# Altium schematic sheet RF_pwr_v2.SchDoc: Материнская плата
size 420 x 297 mm; DrawnBy: В.Титов; DocumentNumber: ХХХХ.468179.001 Э3; SheetNumber: 3; SheetTotal: 3; DocumentType: Схема электрическая принципиальная; Title2: Питание процессора
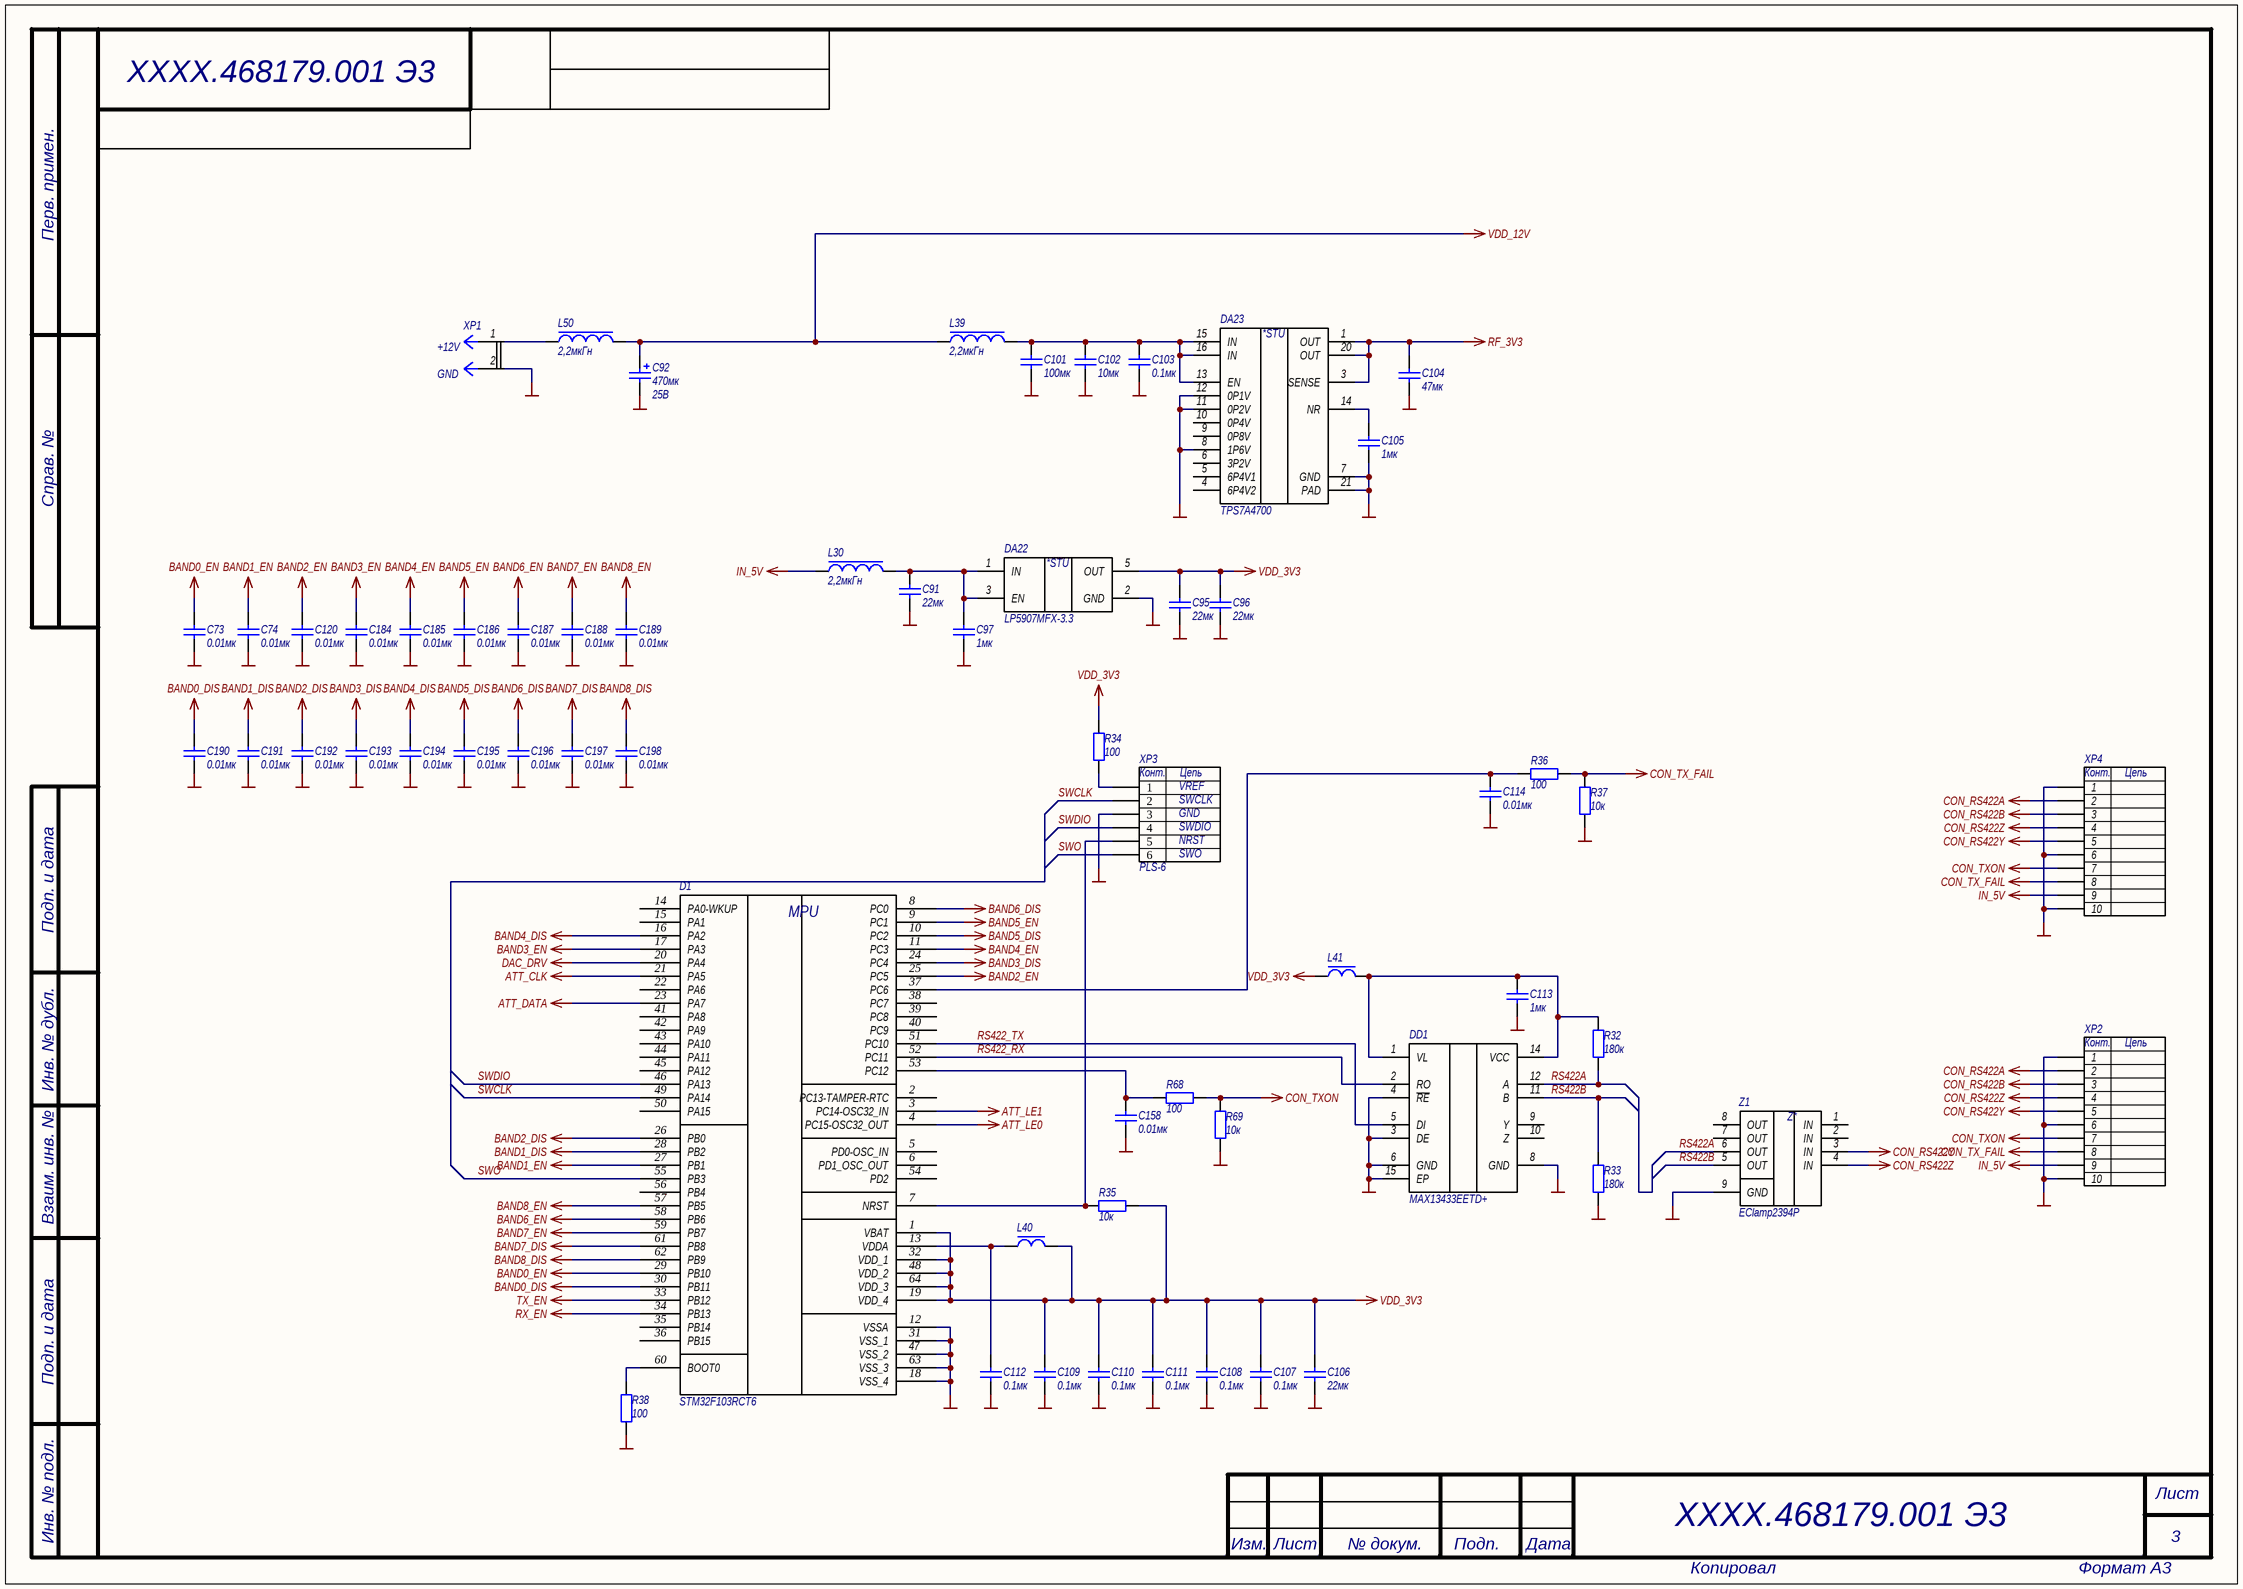
[diagram p0: RF_pwr_v2.SchDoc]

## Parts
C73  0.01мк  [CAPC1005X06N]
C74  0.01мк  [CAPC1005X06N]
C91  22мк  [CAPC2012X12L]
C92  Power/Voltage: 25В  [CAPAE116103X105N]  (hidden comment: 470мк)
C95  22мк  [CAPC2012X12L]
C96  22мк  [CAPC2012X12L]
C97  1мк  [CAPC1005X06N]
C101  100мк  [CAPC3216X19L]
C102  10мк  [CAPC1608X08L]
C103  0.1мк  [CAPC1005X06N]
C104  47мк  [CAPC2012X12L]
C105  1мк  [CAPC1005X06N]
C106  22мк  [CAPC2012X12L]
C107  0.1мк  [CAPC1005X06N]
C108  0.1мк  [CAPC1005X06N]
C109  0.1мк  [CAPC1005X06N]
C110  0.1мк  [CAPC1005X06N]
C111  0.1мк  [CAPC1005X06N]
C112  0.1мк  [CAPC1005X06N]
C113  1мк  [CAPC1005X06N]
C114  0.01мк  [CAPC1005X06N]
C120  0.01мк  [CAPC1005X06N]
C158  0.01мк  [CAPC1005X06N]
C184  0.01мк  [CAPC1005X06N]
C185  0.01мк  [CAPC1005X06N]
C186  0.01мк  [CAPC1005X06N]
C187  0.01мк  [CAPC1005X06N]
C188  0.01мк  [CAPC1005X06N]
C189  0.01мк  [CAPC1005X06N]
C190  0.01мк  [CAPC1005X06N]
C191  0.01мк  [CAPC1005X06N]
C192  0.01мк  [CAPC1005X06N]
C193  0.01мк  [CAPC1005X06N]
C194  0.01мк  [CAPC1005X06N]
C195  0.01мк  [CAPC1005X06N]
C196  0.01мк  [CAPC1005X06N]
C197  0.01мк  [CAPC1005X06N]
C198  0.01мк  [CAPC1005X06N]
D1  STM32F103RCT6  [QFP50P1200X1200X160-64N]
DA22  LP5907MFX-3.3  [SOT23-5AM]
DA23  TPS7A4700  [QFN65P500X500X100_HS-21L]
DD1  MAX13433EETD+  [SON40P300X80_HS-15L]
L30  2,2мкГн  [CSAB0420]
L39  2,2мкГн  [CSAB0420]
L40  BLM18PG121SN1D  [INDC1608X08L]  (value not drawn)
L41  BLM18PG121SN1D  [INDC1608X08L]  (value not drawn)
L50  2,2мкГн  [CSAB0420]
R32  180к  [RESC1005X06N]
R33  180к  [RESC1005X06N]
R34  100  [RESC1005X06N]
R35  10к  [RESC1005X06N]
R36  100  [RESC1005X06N]
R37  10к  [RESC1005X06N]
R38  100  [RESC1005X06N]
R68  100  [RESC1005X06N]
R69  10к  [RESC1005X06N]
XP1  XT30UPB-M  [XT30UPB-M]  (value not drawn)
XP2  FH12-10S-0.5SVA  [FH12-10S-0.5SH]  (value not drawn)
XP3  PLS-6  [HDR1X6]
XP4  FH12-10S-0.5SVA  [FH12-10S-0.5SH]  (value not drawn)
Z1  EClamp2394P  [SON50P160X65_HS-9N]

## Nets
ATT_CLK: D1.21(PA5)
ATT_DATA: D1.23(PA7)
ATT_LE0: D1.4(PC15-OSC32_OUT)
ATT_LE1: D1.3(PC14-OSC32_IN)
BAND0_DIS: C190.2 D1.30(PB11)
BAND0_EN: C73.2 D1.29(PB10)
BAND1_DIS: C191.2 D1.28(PB2)
BAND1_EN: C74.2 D1.27(PB1)
BAND2_DIS: C192.2 D1.26(PB0)
BAND2_EN: C120.2 D1.25(PC5)
BAND3_DIS: C193.2 D1.24(PC4)
BAND3_EN: C184.2 D1.17(PA3)
BAND4_DIS: C194.2 D1.16(PA2)
BAND4_EN: C185.2 D1.11(PC3)
BAND5_DIS: C195.2 D1.10(PC2)
BAND5_EN: C186.2 D1.9(PC1)
BAND6_DIS: C196.2 D1.8(PC0)
BAND6_EN: C187.2 D1.58(PB6)
BAND7_DIS: C197.2 D1.61(PB8)
BAND7_EN: C188.2 D1.59(PB7)
BAND8_DIS: C198.2 D1.62(PB9)
BAND8_EN: C189.2 D1.57(PB5)
CON_RS422A: XP2.2 XP4.2
CON_RS422B: XP2.3 XP4.3
CON_RS422Y: XP2.5 XP4.5 Z1.3(IN)
CON_RS422Z: XP2.4 XP4.4 Z1.4(IN)
CON_TX_FAIL: R36.1 R37.1 XP2.8 XP4.8
CON_TXON: R68.1 R69.1 XP2.7 XP4.7
DAC_DRV: D1.20(PA4)
GND: C73.1 C74.1 C91.1 C92.2 C95.1 C96.1 C97.1 C101.1 C102.1 C103.1 C104.1 C105.1 C106.1 C107.1 C108.1 C109.1 C110.1 C111.1 C112.1 C113.1 C114.1 C120.1 C158.1 C184.1 C185.1 C186.1 C187.1 C188.1 C189.1 C190.1 C191.1 C192.1 C193.1 C194.1 C195.1 C196.1 C197.1 C198.1 D1.12(VSSA) D1.18(VSS_4) D1.31(VSS_1) D1.47(VSS_2) D1.63(VSS_3) DA22.2(GND) DA23.7(GND) DA23.8(1P6V) DA23.11(0P2V) DA23.12(0P1V) DA23.21(PAD) DD1.3(DE) DD1.4(~{RE}) DD1.6(GND) DD1.8(GND) DD1.15(EP) R33.1 R37.2 R38.2 R69.2 XP1.2 XP2.1 XP2.6 XP2.10 XP3.3 XP4.1 XP4.6 XP4.10 Z1.9(GND)
IN_5V: L30.1 XP2.9 XP4.9
RF_3V3: C104.2 DA23.1(OUT) DA23.3(SENSE) DA23.20(OUT)
RX_EN: D1.34(PB13)
TX_EN: D1.33(PB12)
VDD_3V3: C95.2 C96.2 C106.2 C107.2 C108.2 C109.2 C110.2 C111.2 D1.1(VBAT) D1.19(VDD_4) D1.32(VDD_1) D1.48(VDD_2) D1.64(VDD_3) DA22.5(OUT) L40.2 L41.1 R34.1 R35.2
VDD_12V: C92.1 L39.1 L50.2
RS422_RX: D1.52(PC11) DD1.2(RO)
RS422_TX: D1.51(PC10) DD1.5(DI)
RS422A: DD1.12(A) R32.1 Z1.6(OUT)
RS422B: DD1.11(B) R33.2 Z1.5(OUT)
SWCLK: D1.49(PA14) XP3.2
SWDIO: D1.46(PA13) XP3.4
SWO: D1.55(PB3) XP3.6
NetC91_2: C91.2 C97.2 DA22.1(IN) DA22.3(EN) L30.2
NetC101_2: C101.2 C102.2 C103.2 DA23.13(EN) DA23.15(IN) DA23.16(IN) L39.2
NetC105_2: C105.2 DA23.14(NR)
NetC112_2: C112.2 D1.13(VDDA) L40.1
NetC113_2: C113.2 DD1.1(VL) DD1.14(VCC) L41.2 R32.2
NetC114_2: C114.2 D1.37(PC6) R36.2
NetC158_2: C158.2 D1.53(PC12) R68.2
NetD1_7: D1.7(NRST) R35.1 XP3.5
NetD1_60: D1.60(BOOT0) R38.1
NetL50_1: L50.1 XP1.1
NetR34_2: R34.2 XP3.1

Not connected (* = marked no-connect by the designer): D1 2(PC13-TAMPER-RTC) 5(PD0-OSC_IN) 6(PD1_OSC_OUT) 14(PA0-WKUP) 15(PA1) 22(PA6) 35(PB14) 36(PB15) 38(PC7) 39(PC8) 40(PC9) 41(PA8) 42(PA9) 43(PA10) 44(PA11) 45(PA12) 50(PA15) 54(PD2) 56(PB4); DA23 4(6P4V2) 5(6P4V1) 6(3P2V) 9(0P8V) 10(0P4V); DD1 9(Y) 10(Z); Z1 1(IN) 2(IN) 7(OUT) 8(OUT)

## Notes on the sheet
- (near XP1) GND
- (near XP1) +12V
- (near XP3) VREF
- (near XP3) SWCLK
- (near XP3) GND
- (near XP3) SWDIO
- (near XP3) NRST
- (near XP3) SWO
- Перв. примен.
- Справ. №
- Подп. и дата
- Инв. № дубл.
- Взаим. инв. №
- Инв. № подл.
- Лист
- Изм.
- № докум.
- Подп.
- Дата
- Копировал
- Формат А3
- (in symbol Микросхема LP5907MFX-3.3) *STU
- (in symbol Микросхема STM32F103RCT6) MPU
- (in symbol Микросхема TPS7A4700RGW) *STU
- (in symbol Соединитель FH12-10S-0.5SVA) Конт.; Цепь
- (in symbol Соединитель PLS-6) Конт.; Цепь
- (in symbol Фильтр EMI EClamp2394P) Z*

## Library data of the parts
C73 C74 C114 C120 C158 C184-C198 = Кер.ЧИП конд. 0402 0.01мкФ X7R 10%, 50В: Кер. ЧИП-конденсатор; Power/Voltage: 50В; TKE: X7R; Tolerance: ±20%; Value: 0.01мк
C91 C95 C96 C106 = Кер.ЧИП конд. 0805 22мкФ X5R 10% 16В: Кер. ЧИП-конденсатор; Manufacturer: TDK; ManufacturerPartNumber: C2012X5R1C226KT; Power/Voltage: 16В; TKE: X5R; Tolerance: ±10%; Value: 22мк
C92 = Конденсатор гибридный SMD 470мкФ ±20% 25В: Гибридный ЧИП-конденсатор; ManufacturerPartNumber: EEHZK1E471P; Manufacturer: Panasonic; Tolerance: ±20%; Published: 8-Jun-2000; LatestRevisionDate: 29-May-2009; LatestRevisionNote: IPC-7351 Footprint Added.; Publisher: Altium Limited; PackageDescription: ZK series; PackageReference: ZK series; Value: 470мк
C97 C105 C113 = Кер.ЧИП конд. 0402 1мкФ X5R 10%, 10В: Кер. ЧИП-конденсатор; Power/Voltage: 10В; TKE: X5R; Tolerance: ±10%; PackageReference: 0402; Value: 1мк
C101 = Кер.ЧИП конд. 1206 100мкФ X5R 20% 6.3В: Кер. ЧИП-конденсатор; Manufacturer: Murata; ManufacturerPartNumber: GRM31CR60J107ME39L; Power/Voltage: 6.3В; TKE: X5R; Tolerance: ±20%; Value: 100мк
C102 = Кер.ЧИП конд. 0603 10мкФ X5R 20% 6.3В: Кер. ЧИП-конденсатор; Manufacturer: Murata; ManufacturerPartNumber: GRM188R61A106KE69D; Power/Voltage: 6.3В; TKE: X5R; Tolerance: ±20%; Value: 10мк
C103 C107-C112 = Кер.ЧИП конд. 0402 0.1мкФ X7R 10%, 16В: Кер. ЧИП-конденсатор; Power/Voltage: 16В; TKE: X7R; Tolerance: ±10%; PackageReference: 0402; Value: 0.1мк
C104 = Кер.ЧИП конд. 0805 47мкФ X5R 20% 10В: Кер. ЧИП-конденсатор; Manufacturer: Murata; ManufacturerPartNumber: GRM21BR61A476ME15L; Power/Voltage: 10В; TKE: X5R; Tolerance: ±20%; Value: 47мк
D1 = Микросхема STM32F103RCT6: Ultra-low-power 32-bit MCU ARM®-based Cortex®-M3, 128KB Flash, 16KB SRAM, 4KB EEPROM, LCD, USB, ADC, DAC; Manufacturer: STMicroelectronics; Published: 29-Jan-2009; Code_JEDEC: MS-026; ComponentLink1Description: Manufacturer Link; ComponentLink3Description: Packaging Specification; Value: STM32F103RCT6
DA22 = Микросхема LP5907MFX-3.3: 250-mA Ultra-Low-Noise, Low-IQ LDO; Manufacturer: TI; Value: LP5907MFX-3.3; ComponentLink1Description: datasheet; ComponentLink1URL: http://www.ti.com/lit/ds/symlink/lp5907.pdf
DA23 = Микросхема TPS7A4700RGW: 36-V, 1-A, 4-µVRMS, RF LDO Voltage Regulator; Manufacturer: TI; Value: TPS7A4700; ComponentLink1Description: datasheet; ComponentLink1URL: http://www.ti.com/lit/ds/symlink/tps7a47.pdf
DD1 = Микросхема MAX13433EETD+: RS-422 Transceivers with Low-Voltage Logic Interface 16M; Manufacturer: Maxim; Value: MAX13433EETD+; ComponentLink1Description: datasheet; ComponentLink1URL: https://datasheets.maximintegrated.com/en/ds/MAX13430E-MAX13433E.pdf
L30 L39 L50 = ЧИП индуктивность CSAB0420-2R2M: Molding Power Choke; Manufacturer: Vishay; ManufacturerPartNumber: IHLP1616ABER1R0M11; Value: 2,2мкГн
L40 L41 = ЧИП дроссель 0603 BLM18PG121SN1D: SMD EMI Suppression Filter EMIFIL; Manufacturer: Murata; ManufacturerPartNumber: BLM18PG121SN1D; Value: BLM18PG121SN1D
R32 R33 = Чип резистор 0402 180 кОм, 5%: ЧИП-резистор; Tolerance: ±5%; TKE: 100 ppm/°С; PackageReference: 0402; Value: 180к
R34 R36 R38 R68 = Чип резистор 0402 100 Ом, 5%: ЧИП-резистор; Tolerance: ±5%; TKE: 100 ppm/°С; PackageReference: 0402; Value: 100
R35 R37 R69 = Чип резистор 0402 10 кОм, 5%: ЧИП-резистор; Tolerance: ±5%; TKE: 100 ppm/°С; PackageReference: 0402; Value: 10к
XP1 = Соединитель XT30UPB-M: AMASS XT30UPB-M  5 mm; Value: XT30UPB-M
XP2 XP4 = Соединитель FH12-10S-0.5SVA: 0.5mm  Pitch FPC/FFC Connector FH12 Series; Manufacturer: Hirose; Value: FH12-10S-0.5SVA
XP3 = Соединитель PLS-6: Вилка штыревая 2.54мм 1x6 прямая тип1; LatestRevisionDate: 17-Jul-2002; LatestRevisionNote: Re-released for DXP Platform.; Publisher: Altium Limited; Value: PLS-6
Z1 = Фильтр EMI EClamp2394P: ESD/EMI Protection  for Color LCD Interfaces; Manufacturer: SEMTECH; PackageReference: SLP2116P8; Value: EClamp2394P